# Altium schematic sheet INMP441.SchDoc
size A4; SheetNumber: 3; SheetTotal: 3
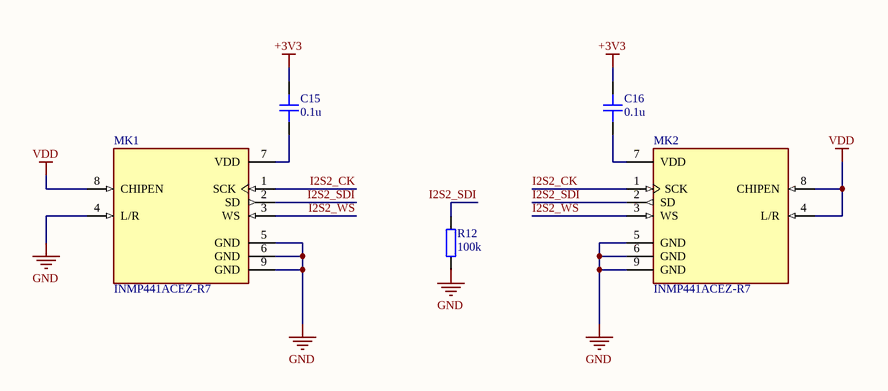
[diagram p0: INMP441.SchDoc]

## Parts
C15  0.1u  [CAP_0402]
C16  0.1u  [CAP_0402]
MK1  INMP441ACEZ-R7  [MIC_INMP441ACEZ-R7]
MK2  INMP441ACEZ-R7  [MIC_INMP441ACEZ-R7]
R12  100k  [RES_0402]

## Nets
+3V3: C15.2 C16.2
GND: MK1.4(L/R) MK1.5(GND) MK1.6(GND) MK1.9(GND) MK2.5(GND) MK2.6(GND) MK2.9(GND) R12.1
VDD: MK1.8(CHIPEN) MK2.4(L/R) MK2.8(CHIPEN)
I2S2_CK: MK1.1(SCK) MK2.1(SCK)
I2S2_SDI: MK1.2(SD) MK2.2(SD) R12.2
I2S2_WS: MK1.3(WS) MK2.3(WS)
NetC15_1: C15.1 MK1.7(VDD)
NetC16_1: C16.1 MK2.7(VDD)

## Library data of the parts
C15 C16 = CAP_0402: Capacitor SMD 0402; Manufacturer: *; Manufacturer Part Number: *; Distributor Link: *; LCSC: *; Rating: *; Dielectric: *
MK1 MK2 = INMP441ACEZ-R7: 60 Hz ~ 15 kHz Digital, I2S Microphone MEMS (Silicon) 1.62 V ~ 3.63 V Omnidirectional (-26dB Â±3dB @ 94dB SPL) Solder Pads; MF: TDK InvenSense; SnapEDA_Link: https://www.snapeda.com/parts/INMP441ACEZ-R7/TDK/view-part/?ref=snap; Package: LGA-9 TDK InvenSense; Value: *; MP: INMP441ACEZ-R7; Check_prices: https://www.snapeda.com/parts/INMP441ACEZ-R7/TDK/view-part/?ref=eda
R12 = RES_0402: Resistor SMD 0402; Manufacturer: *; Manufacturer Part Number: *; Distributor Link: *; LCSC: *